# Altium schematic sheet USB_C.SchDoc: USB-C interface and USB switch
size A4; SheetNumber: 6; SheetTotal: 15; PageSize: A4; Designators: 200-249
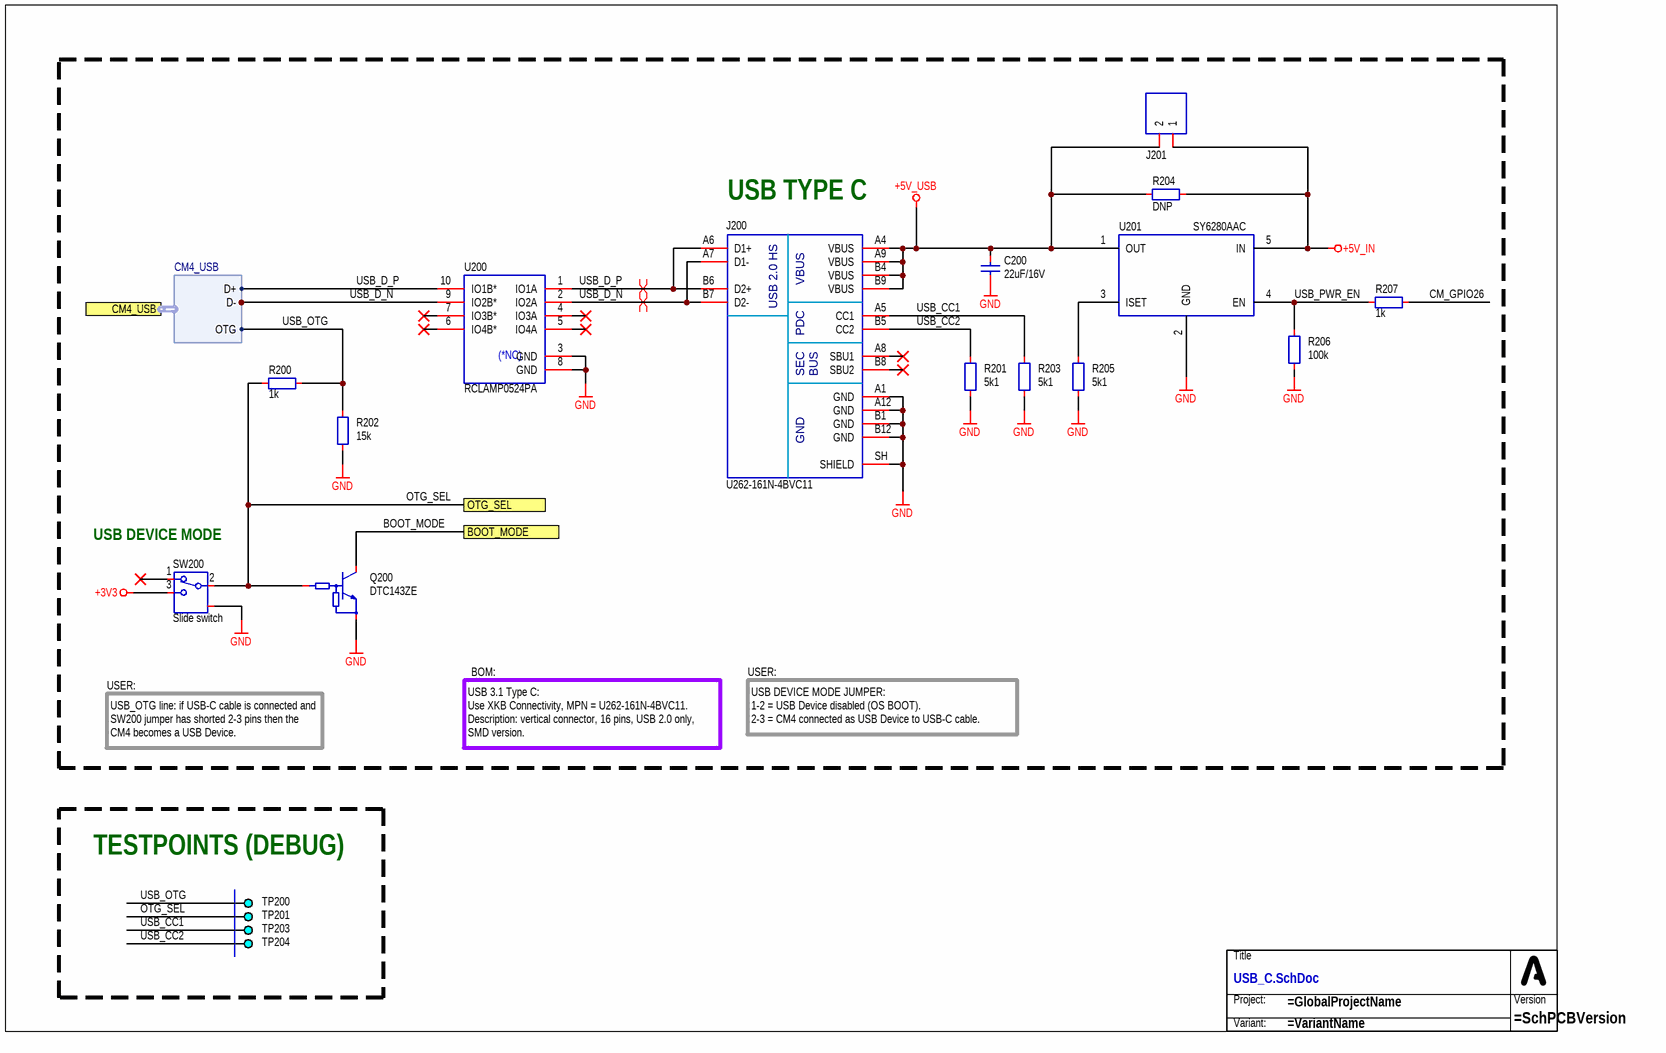
[diagram p0: USB_C.SchDoc]

## Parts
C200  22uF/16V  [CAP_0805_R]
J200  U262-161N-4BVC11  [CON_XKB_U262-161N-4BVC11]
J201  HDR 1x2  [CON_HDR_P254_1X02_STR]  (value not drawn)
Q200  DTC143ZE  [PKG_SOT523_SC75_SOT416_P100_R]
R200  1k  [RES_0603_R]
R201  5k1  [RES_0603_R]
R202  15k  [RES_0603_R]
R203  5k1  [RES_0603_R]
R204  DNP  [RES_1206_R]
R205  5k1  [RES_0603_R]
R206  100k  [RES_0603_R]
R207  1k  [RES_0603_R]
SW200  Slide switch  [SWI_XKB_SS-3292S-L1]
TB?  (no value)  (no BOM)
TP200  DEBUG  [PCB_TP_DBG_50]  (value not drawn)  (no BOM)
TP201  DEBUG  [PCB_TP_DBG_50]  (value not drawn)  (no BOM)
TP203  DEBUG  [PCB_TP_DBG_50]  (value not drawn)  (no BOM)
TP204  DEBUG  [PCB_TP_DBG_50]  (value not drawn)  (no BOM)
U200  RCLAMP0524PA  [ICC_SLP2510P8_250X100X60_P50_R]
U201  SY6280AAC  [PKG_SOT23-5_R]

## Ports
BOOT_MODE, CM4_USB (harness CM4_USB), OTG_SEL

## Harnesses
CM4_USB: D+, D-, OTG

## Nets
+3V3: SW200.3
+5V_IN: J201.1 R204.2 U201.5(IN)
+5V_USB: C200.2 J200.A4(VBUS) J200.A9(VBUS) J200.B4(VBUS) J200.B9(VBUS) J201.2 R204.1 U201.1(OUT)
GND: C200.1 J200.A1(GND) J200.A12(GND) J200.B1(GND) J200.B12(GND) J200.SH(SHIELD) Q200.2(E) R201.2 R202.1 R203.2 R205.2 R206.1 SW200.SH U200.3(GND) U200.8(GND) U201.2(GND)
BOOT_MODE: Q200.3(C) ; port BOOT_MODE
CM_GPIO26: R207.1
OTG_SEL: Q200.1(B) R200.2 SW200.2 TP201.1 ; port OTG_SEL
USB_CC1: J200.A5(CC1) R203.1 TP203.1
USB_CC2: J200.B5(CC2) R201.1 TP204.1
USB_D_N: J200.A7(D1-) J200.B7(D2-) U200.2(IO2A) U200.9(IO2B*) ; port CM4_USB.D-
USB_D_P: J200.A6(D1+) J200.B6(D2+) U200.1(IO1A) U200.10(IO1B*) ; port CM4_USB.D+
USB_OTG: R200.1 R202.2 TP200.1 ; port CM4_USB.OTG
USB_PWR_EN: R206.2 R207.2 U201.4(EN)
NetR205_1: R205.1 U201.3(ISET)

Not connected (* = marked no-connect by the designer): J200 A8(SBU1)* B8(SBU2)*; SW200 1*; U200 4(IO3A)* 5(IO4A)* 6(IO4B*)* 7(IO3B*)*

## Layout directives
differential pair: USB_D_N, USB_D_P

## Notes on the sheet
- (near J200) USB TYPE C
- (near SW200) USB DEVICE MODE
- USER:
- BOM:
- USB_OTG line: if USB-C cable is connected and SW200 jumper has shorted 2-3 pins then the CM4 becomes a USB Device.
- USB 3.1 Type C:
  Use XKB Connectivity, MPN = U262-161N-4BVC11.
  Description: vertical connector, 16 pins, USB 2.0 only, SMD version.
- USB DEVICE MODE JUMPER:
  1-2 = USB Device disabled (OS BOOT).
  2-3 = CM4 connected as USB Device to USB-C cable.
- TESTPOINTS (DEBUG)
- (in symbol CON_USB_TYPE_C_16P) USB 2.0 HS; PDC; SEC; BUS
- (in symbol ICC-0005) (*NC)
- (in symbol SCH_TITLE_BLOCK_SIMPLE_NODATE) Title; Project:; Version; Variant:

## Library data of the parts
C200 = CAP-0024: Capacitor; MLCC; 22u 16V; Manufacturer: Samsung Electro-Mechanics; MPN: CL21A226MOQNNNE; Package (Case): 0805; Component Type: Capacitor; Component Subtype: MLCC; Value: 22uF/16V; Mounting Type: SMD
J200 = CON_USB_TYPE_C_16P: Connector; USB 3.1 Type C; Receptacle; 24-pin; USB 2.0 Only;; Manufacturer: XKB Connectivity; Component Subtype: USB-C; Package (Case): SMD; Value: U262-161N-4BVC11; MPN: U262-161N-4BVC11; Component Type: Connector; Mounting Type: SMD
J201 = CON-0020: CONN THT / HEADER / PITCH 2,54mm / VERTICAL / (2 PIN); Manufacturer: Ckmtw(Shenzhen Cankemeng); MPN: B-2100S02P-A110; Component Subtype: Pin Header; Component Type: Connector; Value: HDR 1x2; Mounting Type: THT; Package (Case): THT
Q200 = TRA_BJT_NPN_DIG_BEC: Transistor; BJT; NPN; Digital;; Manufacturer: On Semiconductor; Component Subtype: NPN Transistor; Package (Case): SOT-523; Value: DTC143ZE; MPN: DTC143ZE; Component Type: Transistor; Mounting Type: SMD
R200 R207 = RES-0027: Resistor; Thick Film; 1k; 1%; 100mW; 100PPM; 75V; Standard; SMD; 0603 (1608);; Manufacturer: UNI-ROYAL(Uniroyal Elec); MPN: 0603WAF1001T5E; Package (Case): 0603; Component Type: Resistor; Component Subtype: Thick Film; Value: 1k; Mounting Type: SMD
R201 R203 R205 = RES-0043: Resistor; Thick Film; 5k1; 1%; 100mW; 100PPM; 75V; Standard; SMD; 0603 (1608);; Manufacturer: UNI-ROYAL(Uniroyal Elec); MPN: 0603WAF5101T5E; Package (Case): 0603; Component Type: Resistor; Component Subtype: Thick Film; Value: 5k1; Mounting Type: SMD
R202 = RES-0043: Resistor; Thick Film; 15k; 1%; 100mW; 100PPM; 75V; Standard; SMD; 0603 (1608);; Manufacturer: UNI-ROYAL(Uniroyal Elec); MPN: 0603WAF1502T5E; Package (Case): 0603; Component Type: Resistor; Component Subtype: Thick Film; Value: 15k; Mounting Type: SMD
R204 = RES-0060: Component Subtype: Thick Film; Package (Case): 1206; Component Type: Resistor; Value: DNP; Mounting Type: SMD
R206 = RES-0029: Resistor; Thick Film; 100k; 1%; 100mW; 100PPM; 75V; Standard; SMD; 0603 (1608);; Manufacturer: UNI-ROYAL(Uniroyal Elec); MPN: 0603WAF1003T5E; Package (Case): 0603; Component Type: Resistor; Component Subtype: Thick Film; Value: 100k; Mounting Type: SMD
SW200 = SWI_SPDT_3P_SH1: Switch; SPDT;; Manufacturer: XKB Connectivity; MPN: SS-3292S-L1; Package (Case): SMD; Component Subtype: Slide; Component Type: Switch; Mounting Type: SMD; Value: Slide switch
TB? = SCH_TITLE_BLOCK_SIMPLE_NODATE
TP200 TP201 TP203 TP204 = PCB_TP_DBG: PCB Marking; Test Point (Debug);; Value: DEBUG; Component Type: Testpoint
U200 = ICC-0005: IC; TVS Arrays; ESD Protection; 4-Channel; 17kV Air; 12kV Contact; 0.3pF Capitance; TBD; SMD; TBD;; Manufacturer: Semtech Corporation; MPN: RCLAMP0524PATCT; Package (Case): DFN-10(1x2.5); Component Type: IC; Component Subtype: TVS Arrays; Value: RCLAMP0524PA; Mounting Type: SMD
U201 = ITEM_U10052: IC SMD / LOAD SWITCH / 2.4V - 5.5V (SOT-23-5); Manufacturer: Silergy Corp; Package (Case): SOT-23-5; Mounting Type: SMD; MPN: SY6280AAC; Value: SY6280AAC